# Altium schematic sheet RemotoXBee.SchDoc
size A4
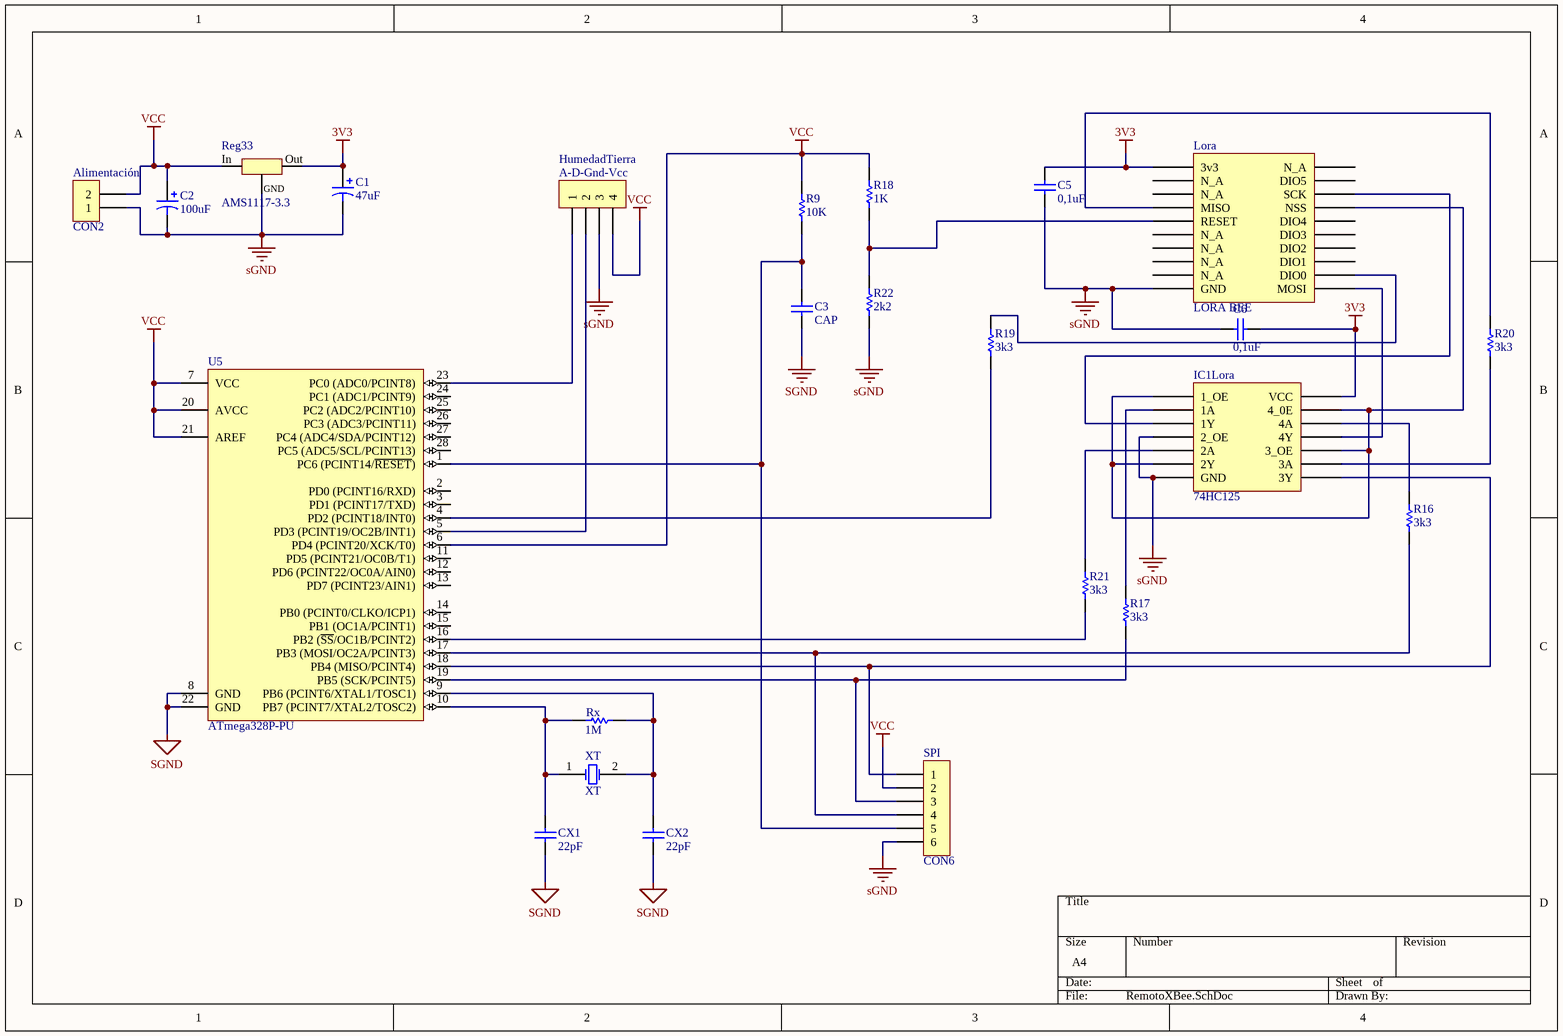
[diagram p0: RemotoXBee.SchDoc]

## Parts
Alimentación  CON2  [BORNERA2 - T]
C1  47uF  [CAPPOL100]
C2  100uF  [CAPPOL100]
C3  CAP  [CAP200]
C5  0,1uF  [CAP100]
C6  0,1uF  [CAP100]
CX1  22pF  [CAP200]
CX2  22pF  [CAP200]
HumedadTierra  A-D-Gnd-Vcc  [CON4]
IC1Lora  74HC125  [DIP14B]
Lora  LORA BEE  [LORABEE]
R9  10K  [RES400]
R16  3k3  [RES300]
R17  3k3  [RES300]
R18  1K  [RES300]
R19  3k3  [RES300]
R20  3k3  [RES300]
R21  3k3  [RES300]
R22  2k2  [RES300]
Reg33  AMS1117-3.3  [SOT223]
Rx  1M  [RES400]
SPI  CON6  [CON2X3]
U5  ATmega328P-PU  [32A_N]
XT  XT  [XT]

## Nets
3V3: C1.1 C5.2 C6.2 IC1Lora.14(VCC) Lora.1(3v3) Reg33.2
sGND: Alimentación.1 C1.2 C2.2 C3.1 C5.1 C6.1 CX1.1 CX2.1 HumedadTierra.3 IC1Lora.4(2_OE) IC1Lora.7(GND) Lora.10(GND) R22.1 Reg33.1 SPI.6 U5.8(GND) U5.22(GND)
VCC: Alimentación.2 C2.1 HumedadTierra.4 R9.2 R18.2 Reg33.3 SPI.2 U5.6(PD4_(PCINT20/XCK/T0)) U5.7(VCC) U5.20(AVCC) U5.21(AREF)
NetC3_2: C3.2 R9.1 SPI.5 U5.1(PC6_(PCINT14/~{RESET}))
NetCX1_2: CX1.2 Rx.1 U5.10(PB7_(PCINT7/XTAL2/TOSC2)) XT.1(OSC1)
NetCX2_2: CX2.2 Rx.2 U5.9(PB6_(PCINT6/XTAL1/TOSC1)) XT.2(OSC2)
NetHumedadTierra_1: HumedadTierra.1 U5.23(PC0_(ADC0/PCINT8))
NetHumedadTierra_2: HumedadTierra.2 U5.5(PD3_(PCINT19/OC2B/INT1))
NetIC1Lora_1: IC1Lora.1(1_OE) IC1Lora.6(2Y) IC1Lora.10(3_OE) IC1Lora.13(4_0E) Lora.17(NSS)
NetIC1Lora_2: IC1Lora.2(1A) R17.2
NetIC1Lora_3: IC1Lora.3(1Y) Lora.18(SCK)
NetIC1Lora_5: IC1Lora.5(2A) R21.2
NetIC1Lora_8: IC1Lora.8(3Y) SPI.1 U5.18(PB4_(MISO/PCINT4))
NetIC1Lora_9: IC1Lora.9(3A) R20.1
NetIC1Lora_11: IC1Lora.11(4Y) Lora.11(MOSI)
NetIC1Lora_12: IC1Lora.12(4A) R16.2
NetLora_4: Lora.4(MISO) R20.2
NetLora_5: Lora.5(RESET) R18.1 R22.2
NetLora_12: Lora.12(DIO0) R19.2
NetR16_1: R16.1 SPI.4 U5.17(PB3_(MOSI/OC2A/PCINT3))
NetR17_1: R17.1 SPI.3 U5.19(PB5_(SCK/PCINT5))
NetR19_1: R19.1 U5.4(PD2_(PCINT18/INT0))
NetR21_1: R21.1 U5.16(PB2_(~{SS}/OC1B/PCINT2))

Not connected (* = marked no-connect by the designer): Lora 2(N_A) 3(N_A) 6(N_A) 7(N_A) 8(N_A) 9(N_A) 13(DIO1) 14(DIO2) 15(DIO3) 16(DIO4) 19(DIO5) 20(N_A); U5 2(PD0_(PCINT16/RXD)) 3(PD1_(PCINT17/TXD)) 11(PD5_(PCINT21/OC0B/T1)) 12(PD6_(PCINT22/OC0A/AIN0)) 13(PD7_(PCINT23/AIN1)) 14(PB0_(PCINT0/CLKO/ICP1)) 15(PB1_(OC1A/PCINT1)) 24(PC1_(ADC1/PCINT9)) 25(PC2_(ADC2/PCINT10)) 26(PC3_(ADC3/PCINT11)) 27(PC4_(ADC4/SDA/PCINT12)) 28(PC5_(ADC5/SCL/PCINT13))

## Notes on the sheet
- (in symbol AMS1117-3.3) In; Out; GND

## Library data of the parts
Alimentación = CON2: Conector 2
C1 C2 = CAPPOL: Capacitor Polarizado
C3 C5 C6 CX1 CX2 = CAP: Capacitor
HumedadTierra = CON4: Conector 4
R9 R16-R22 Rx = RES: Resistencia
SPI = CON6: Conector 6
U5 = ATmega328P-PU: 8-bit AVR Microcontroller, 32KB Flash, 1KB EEPROM, 2KB SRAM, 28-pin PDIP, Industrial Grade (-40°C to 85°C); Published: 1-Apr-2010; DatasheetVersion: revA, Jan-2010; PackageVersion: revB, Sep-2001; PackageReference: 28P3; Publisher: Altium Limited; PackageDescription: 28-lead (0.300"/7.62mm Wide) Plastic Dual Inline Package (PDIP); Supplier 1: Digi-Key; Supplier Part Number 1: ATMEGA328P-PU-ND; Supplier 2: Farnell; Supplier Part Number 2: 1715487; Supplier 3: Mouser; Supplier Part Number 3: 556-ATMEGA328P-PU; ComponentLink1Description: Manufacturer Link; ComponentLink1URL: http://www.atmel.com/products/avr/default.asp?; ComponentLink2Description: ATmega48A/48PA/88A/88PA/168A/168PA/328/328P Datasheet; ComponentLink2URL: http://www.atmel.com/dyn/resources/prod_documents/8271.pdf; ComponentLink3Description: ATmega48A/48PA/88A/88PA/168A/168PA/328/328P Summary; ComponentLink3URL: http://www.atmel.com/dyn/resources/prod_documents/8271S.pdf; ComponentLink4Description: Atmel.com Home; ComponentLink4URL: http://www.atmel.com
XT = XT: Cristal de Quarzo